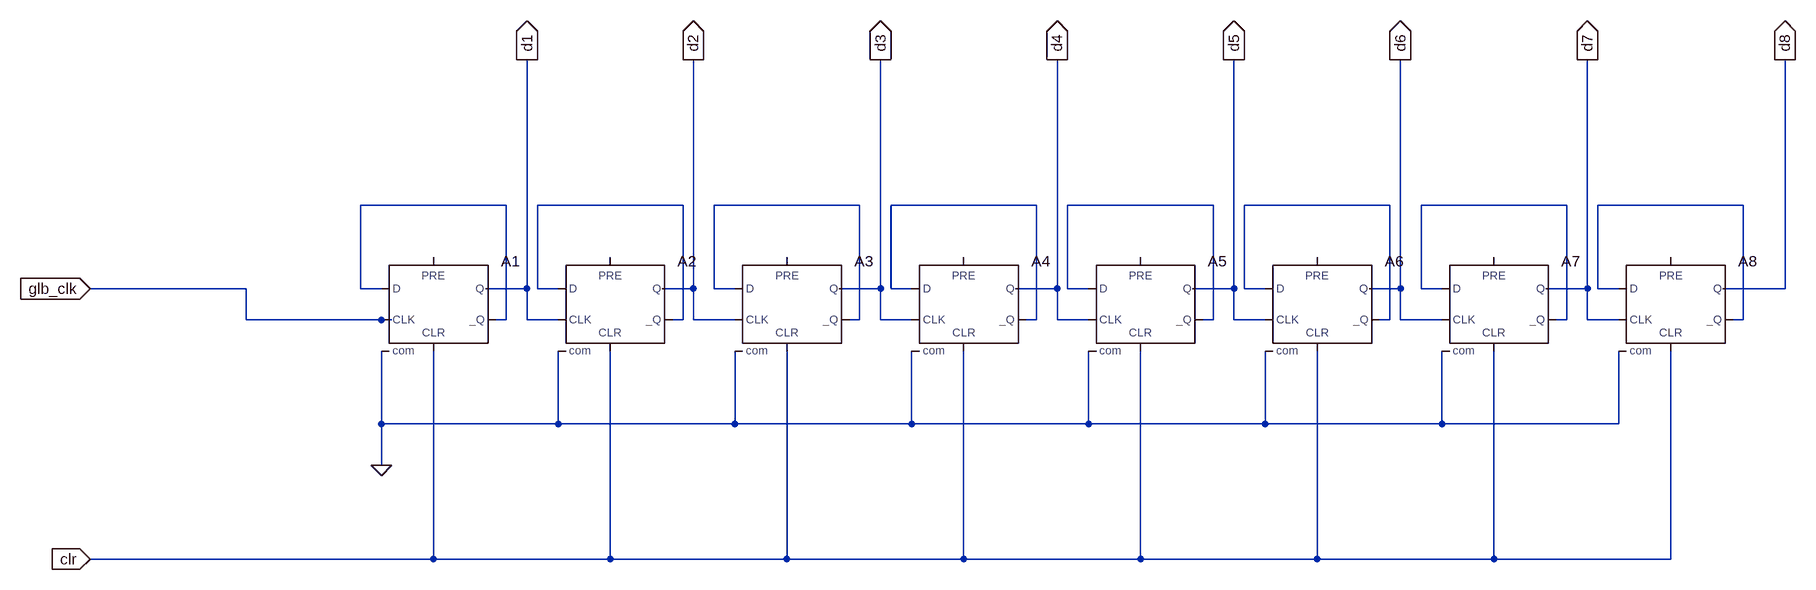
[diagram p0: schematic shared_ctr.asc]
shared_ctr.asc, the LTspice schematic file:
Version 4
SHEET 1 2524 764
WIRE 496 160 272 160
WIRE 768 160 544 160
WIRE 1040 160 816 160
WIRE 1312 160 1088 160
WIRE 1584 160 1360 160
WIRE 1856 160 1632 160
WIRE 2128 160 1904 160
WIRE 2400 160 2176 160
WIRE 96 288 -144 288
WIRE 272 288 272 160
WIRE 304 288 272 288
WIRE 528 288 528 -64
WIRE 528 288 464 288
WIRE 544 288 544 160
WIRE 576 288 544 288
WIRE 784 288 784 -64
WIRE 784 288 736 288
WIRE 816 288 816 160
WIRE 848 288 816 288
WIRE 1072 288 1072 -64
WIRE 1072 288 1008 288
WIRE 1088 288 1088 160
WIRE 1120 288 1088 288
WIRE 1344 288 1344 -64
WIRE 1344 288 1280 288
WIRE 1360 288 1360 160
WIRE 1392 288 1360 288
WIRE 1616 288 1616 -64
WIRE 1616 288 1552 288
WIRE 1632 288 1632 160
WIRE 1664 288 1632 288
WIRE 1872 288 1872 -64
WIRE 1872 288 1824 288
WIRE 1904 288 1904 160
WIRE 1936 288 1904 288
WIRE 2160 288 2160 -64
WIRE 2160 288 2096 288
WIRE 2176 288 2176 160
WIRE 2208 288 2176 288
WIRE 2464 288 2464 -64
WIRE 2464 288 2368 288
WIRE 96 336 96 288
WIRE 304 336 96 336
WIRE 320 336 304 336
WIRE 496 336 496 160
WIRE 496 336 480 336
WIRE 528 336 528 288
WIRE 576 336 528 336
WIRE 768 336 768 160
WIRE 768 336 752 336
WIRE 784 336 784 288
WIRE 848 336 784 336
WIRE 1040 336 1040 160
WIRE 1040 336 1024 336
WIRE 1072 336 1072 288
WIRE 1120 336 1072 336
WIRE 1312 336 1312 160
WIRE 1312 336 1296 336
WIRE 1344 336 1344 288
WIRE 1392 336 1344 336
WIRE 1584 336 1584 160
WIRE 1584 336 1568 336
WIRE 1616 336 1616 288
WIRE 1664 336 1616 336
WIRE 1856 336 1856 160
WIRE 1856 336 1840 336
WIRE 1872 336 1872 288
WIRE 1936 336 1872 336
WIRE 2128 336 2128 160
WIRE 2128 336 2112 336
WIRE 2160 336 2160 288
WIRE 2208 336 2160 336
WIRE 2400 336 2400 160
WIRE 2400 336 2384 336
WIRE 304 496 304 384
WIRE 576 496 576 384
WIRE 576 496 304 496
WIRE 848 496 848 384
WIRE 848 496 576 496
WIRE 1120 496 1120 384
WIRE 1120 496 848 496
WIRE 1392 496 1392 384
WIRE 1392 496 1120 496
WIRE 1664 496 1664 384
WIRE 1664 496 1392 496
WIRE 1936 496 1936 384
WIRE 1936 496 1664 496
WIRE 2208 496 2208 384
WIRE 2208 496 1936 496
WIRE 304 560 304 496
WIRE 384 704 384 384
WIRE 384 704 -144 704
WIRE 656 704 656 384
WIRE 656 704 384 704
WIRE 928 704 928 384
WIRE 928 704 656 704
WIRE 1200 704 1200 384
WIRE 1200 704 928 704
WIRE 1472 704 1472 384
WIRE 1472 704 1200 704
WIRE 1744 704 1744 384
WIRE 1744 704 1472 704
WIRE 2016 704 2016 384
WIRE 2016 704 1744 704
WIRE 2288 704 2288 384
WIRE 2288 704 2016 704
FLAG -144 288 glb_clk
IOPIN -144 288 In
FLAG 304 560 0
FLAG 2464 -64 d8
IOPIN 2464 -64 Out
FLAG 2160 -64 d7
IOPIN 2160 -64 Out
FLAG 1872 -64 d6
IOPIN 1872 -64 Out
FLAG 1616 -64 d5
IOPIN 1616 -64 Out
FLAG 1344 -64 d4
IOPIN 1344 -64 Out
FLAG 1072 -64 d3
IOPIN 1072 -64 Out
FLAG 784 -64 d2
IOPIN 784 -64 Out
FLAG 528 -64 d1
IOPIN 528 -64 Out
FLAG -144 704 clr
IOPIN -144 704 In
SYMBOL dflop 1472 240 R0
SYMATTR InstName A5
SYMBOL dflop 1744 240 R0
SYMATTR InstName A6
SYMBOL dflop 2016 240 R0
SYMATTR InstName A7
SYMBOL dflop 2288 240 R0
SYMATTR InstName A8
SYMBOL dflop 384 240 R0
SYMATTR InstName A1
SYMBOL dflop 656 240 R0
SYMATTR InstName A2
SYMBOL dflop 928 240 R0
SYMATTR InstName A3
SYMBOL dflop 1200 240 R0
SYMATTR InstName A4

The netlist it stands for:
* shared_ctr.asc
A5 N005 0 d4 0 clr N005 d5 0 DFLOP
A6 N006 0 d5 0 clr N006 d6 0 DFLOP
A7 N007 0 d6 0 clr N007 d7 0 DFLOP
A8 N008 0 d7 0 clr N008 d8 0 DFLOP
A1 N001 0 glb_clk 0 clr N001 d1 0 DFLOP
A2 N002 0 d1 0 clr N002 d2 0 DFLOP
A3 N003 0 d2 0 clr N003 d3 0 DFLOP
A4 N004 0 d3 0 clr N004 d4 0 DFLOP
.backanno
.end